# EAGLE design LIC_rack_backplane_Con-00 (EAGLE 7.2.0)
AUTHOR: M. Petrilak; VERSION: 0.1

## Sheet 1 of 2
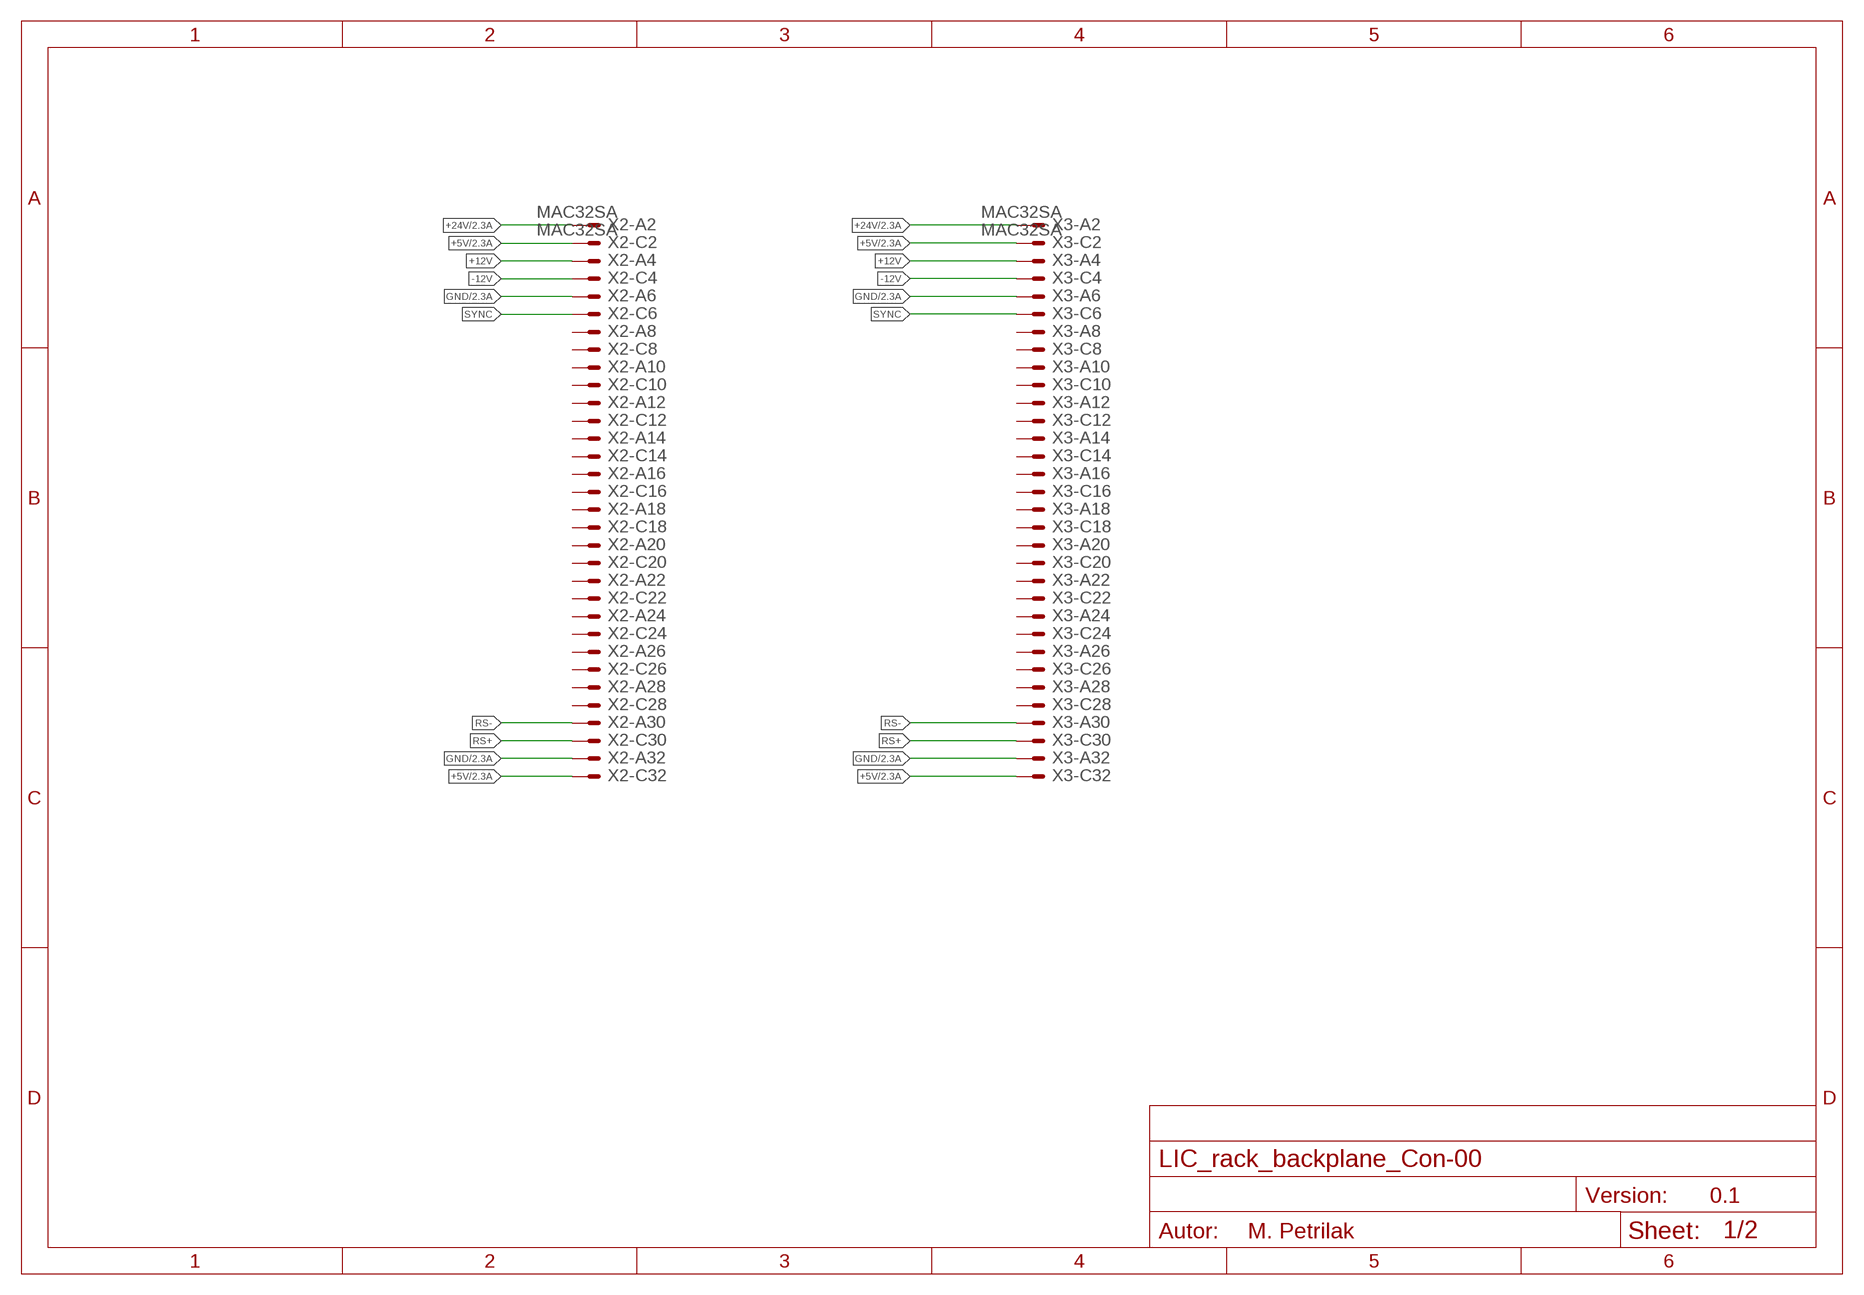
[diagram p0: schematic, sheet 1]

### Parts
X2  MAC32SA  [MAC32SA]
X3  MAC32SA  [MAC32SA]

### Nets
+5V: X2.C2 X2.C32 X3.C2 X3.C32 ; also sheet 2
+12V: X2.A4 X3.A4
+24V: X2.A2 X3.A2 ; also sheet 2
-12V: X2.C4 X3.C4
GND: X2.A6 X2.A32 X3.A6 X3.A32 ; also sheet 2
RS+: X2.C30 X3.C30
RS-: X2.A30 X3.A30
SYNC: X2.C6 X3.C6
Unconnected: X2.A8 X2.A10 X2.A12 X2.A14 X2.A16 X2.A18 X2.A20 X2.A22 X2.A24 X2.A26 X2.A28 X2.C8 X2.C10 X2.C12 X2.C14 X2.C16 X2.C18 X2.C20 X2.C22 X2.C24 X2.C26 X2.C28 X3.A8 X3.A10 X3.A12 X3.A14 X3.A16 X3.A18 X3.A20 X3.A22 X3.A24 X3.A26 X3.A28 X3.C8 X3.C10 X3.C12 X3.C14 X3.C16 X3.C18 X3.C20 X3.C22 X3.C24 X3.C26 X3.C28

## Sheet 2 of 2
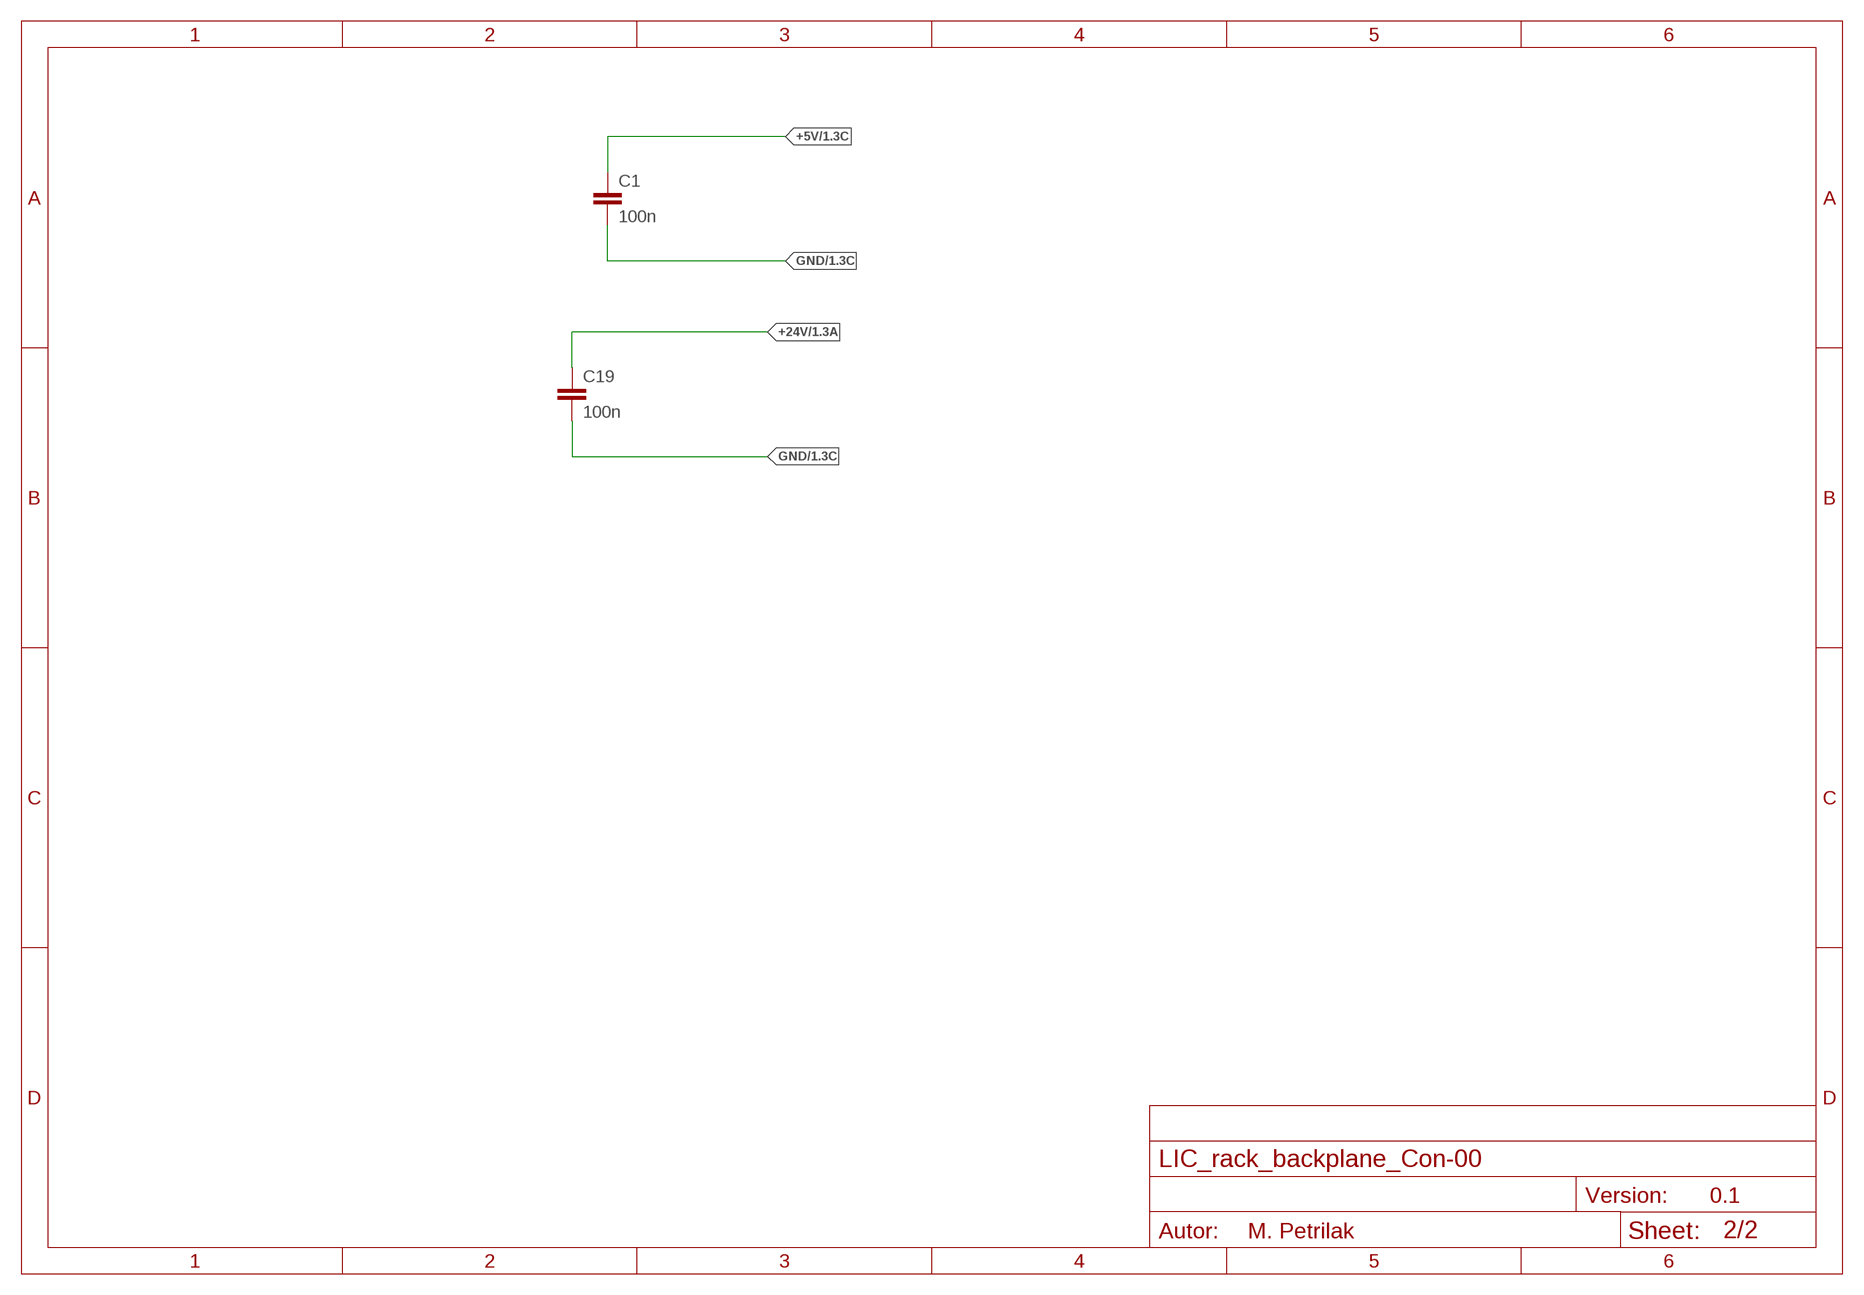
[diagram p1: schematic, sheet 2]

### Parts
C1  100n  C-EUC1206  [C1206]
C19  100n  C-EUC1206  [C1206]

### Nets
+5V: C1.1 ; also sheet 1
+24V: C19.1 ; also sheet 1
GND: C1.2 C19.2 ; also sheet 1

## Library data of the parts
C1 C19 = rcl:C-EU: CAPACITOR, European symbol
X2 X3 = con-vg:MAC32SA: CONNECTOR male, 32 pins, type D, rows AC, grid 5.08 mm

## Net classes
0 default: clearance 0.2 mm
1 LNPE: clearance 2.5 mm to class 0, clearance 1 mm

## Board
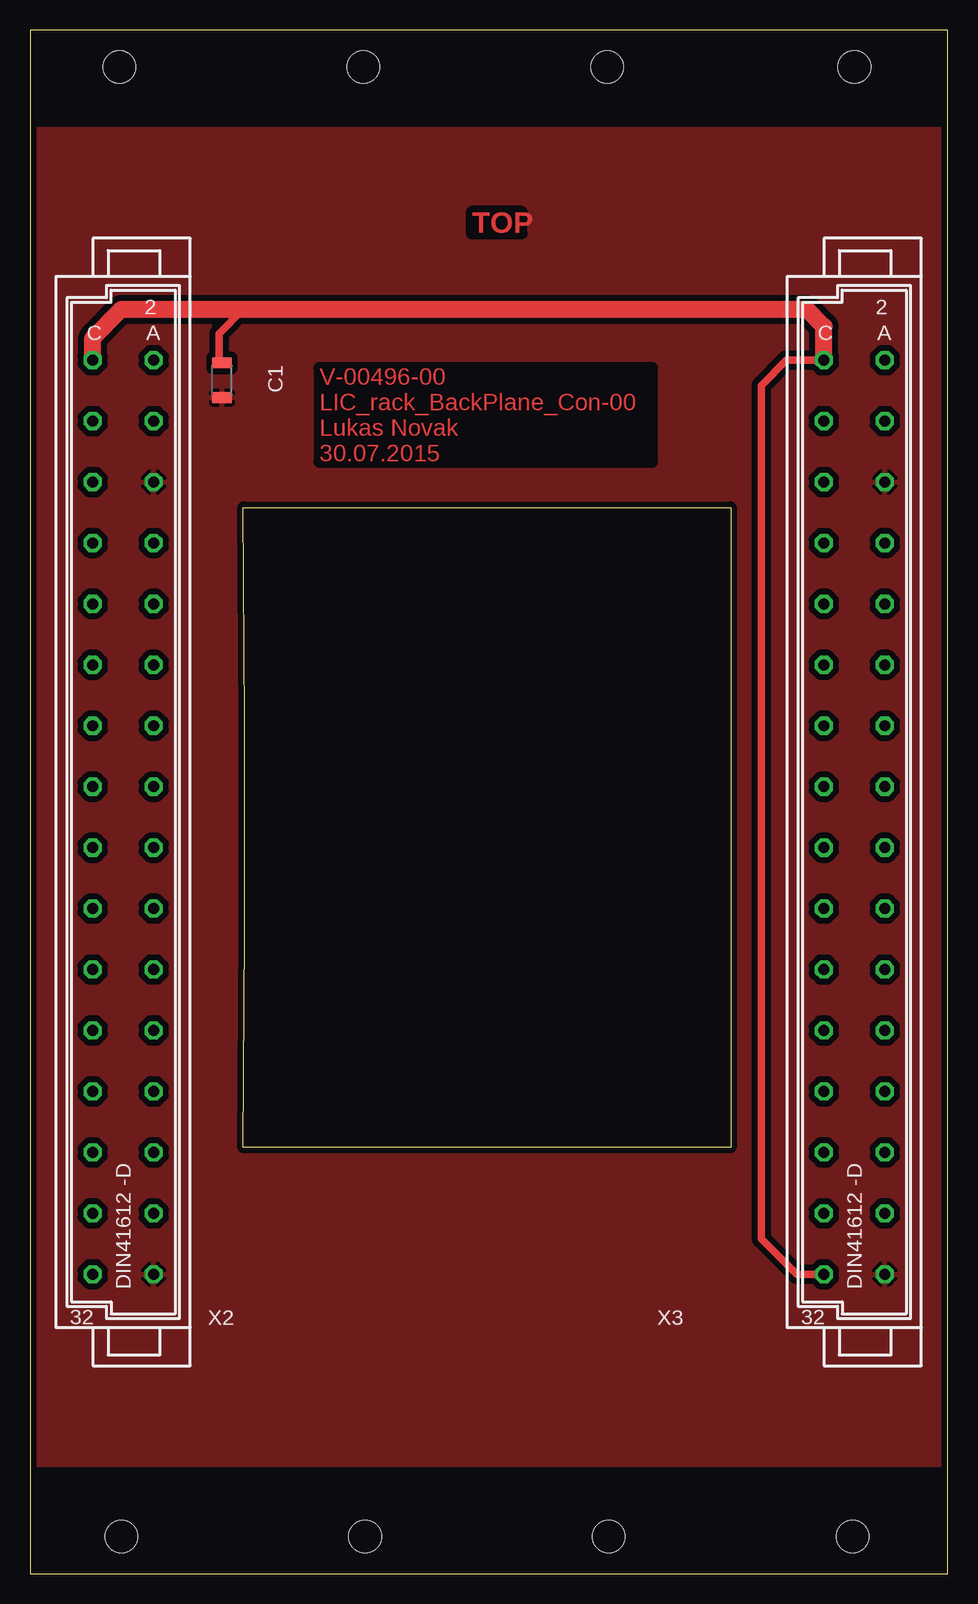
[diagram p2: board, top side]
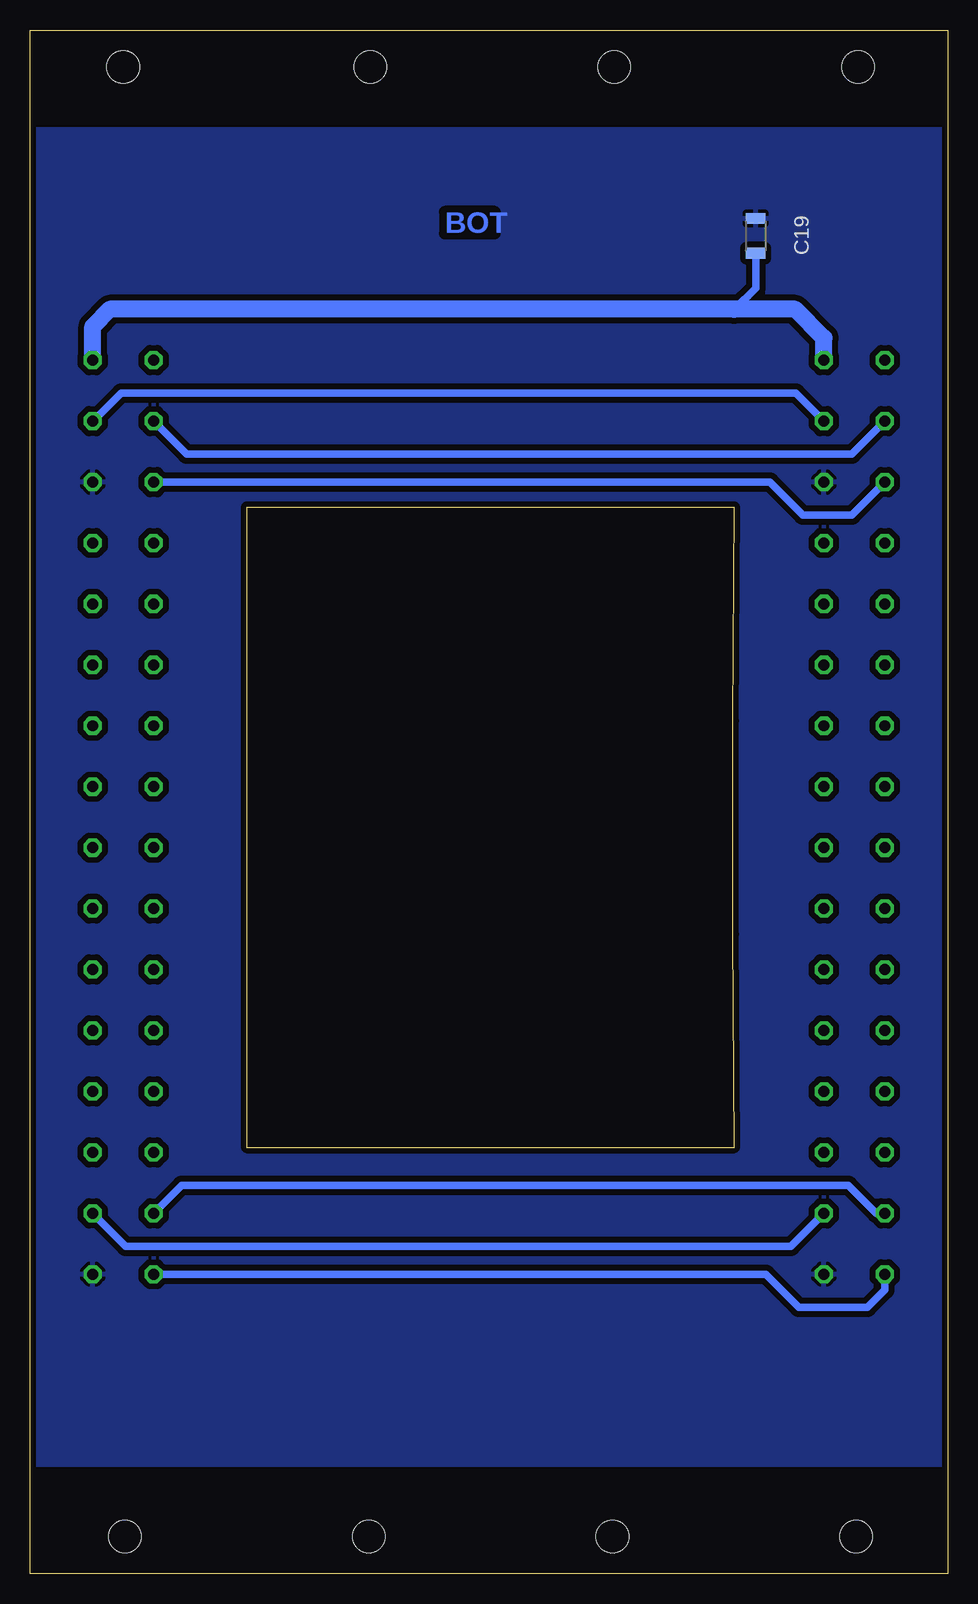
[diagram p3: board, bottom side, seen from below]

Size 76.5 x 128.7 mm. Coordinates in mm from the lower left corner, seen from the top.
Outline: 0,0 76.5,0 76.5,128.7 0,128.7 0,0
Outline: 17.78,88.9 58.42,88.9 58.42,35.56 17.78,35.56 arc1 17.78,88.9
Copper layers (1*16): Top 0.04mm / dielectric 1.5mm / Bottom 0.04mm
Design rules "mucha_navrh *": minimum track width 0.2mm, minimum drill 0.6mm, track to track 0.5mm, track to pad 0.5mm, pad to pad 0.3mm, via to via 0.3mm, smd to smd 0mil, copper to edge 0.5mm, drill to drill 0.5mm, minimum pad ring 0.3mm, minimum via ring 0.3mm, stop-mask expansion 0.1mm, vias tented up to drill 0.8mm, thermal gap 0.3mm
Holes 2.7 mm at 7.47,125.6 27.79,125.6 48.11,125.6 68.73,125.6 7.62,3.1 27.94,3.1 48.26,3.1 68.58,3.1
tRestrict: area 0,120.7 to 76.2,128.3; area 0,0 to 76.2,8.9
bRestrict: area 17.8,35.6 to 58.4,88.9; area 0,0 to 76.2,8.9; area 0,120.7 to 76.2,128.3; 4 lines
vRestrict: area 0,120.7 to 76.2,128.3; area 0,0 to 76.2,8.9

### Footprints (pad centres in the part's own frame; a part is rotated, then mirrored left to right if it is on the bottom)
C1206 = smd 0.9 x 1.6: 1 -1.45,0; 2 1.45,0
MAC32SA = drill 0.914 octagon: A2 2.54,36.83; A4 2.54,31.75; A6 2.54,26.67; A8 2.54,21.59; A10 2.54,16.51; A12 2.54,11.43; A14 2.54,6.35; A16 2.54,1.27; A18 2.54,-3.81; A20 2.54,-8.89; A22 2.54,-13.97; A24 2.54,-19.05; A26 2.54,-24.13; A28 2.54,-29.21; A30 2.54,-34.29; A32 2.54,-39.37; C2 -2.54,36.83; C4 -2.54,31.75; C6 -2.54,26.67; C8 -2.54,21.59; C10 -2.54,16.51; C12 -2.54,11.43; C14 -2.54,6.35; C16 -2.54,1.27; C18 -2.54,-3.81; C20 -2.54,-8.89; C22 -2.54,-13.97; C24 -2.54,-19.05; C26 -2.54,-24.13; C28 -2.54,-29.21; C30 -2.54,-34.29; C32 -2.54,-39.37

### Placement (x,y rotation side)
C1  16,99.5 270 top
C19  16,111.54 90 bottom
X2  7.77,64.35 0 top
X3  68.73,64.35 0 top

### Tracks (layer width: path | path; a pad name or v marks a point on that pad's centre or on a via)
+5V
  Top 0.406: 15.77,101.18 C1.1
  Top 0.61: 15.77,101.18 15.77,103.4 17.78,105.41 | X3.C32 63.92,24.98 60.96,27.94 60.96,99.06 63.08,101.18 X3.C2
  Top 1.422: X2.C2 5.23,103.02 7.62,105.41 17.78,105.41 64.77,105.41 66.19,103.99 X3.C2
  Bottom 0.61: X3.C32 15.14,24.98 12.38,22.23 6.67,22.23 5.23,23.66 X2.C32
+12V
  Bottom 0.61: X3.A4 71.22,96.1 68.9,98.42 12.63,98.42 X2.A4
+24V
  Bottom 0.61: C19.1 16,107.19 17.78,105.41
  Bottom 1.422: X2.A2 10.31,103.02 12.7,105.41 17.78,105.41 69.85,105.41 71.27,103.99 X3.A2
-12V
  Bottom 0.61: X3.C4 63.44,93.34 7.99,93.34 X2.C4
GND
  pour Bottom (rank 2): 0,0 76.5,0 76.5,128.7 0,128.7
  pour Top (rank 2): 0,0 76.5,0 76.5,128.7 0,128.7
RS+
  Bottom 0.61: X2.C30 5.93,30.06 8.26,32.38 63.87,32.38 X3.C30
RS-
  Bottom 0.61: X3.A30 68.52,27.3 13.06,27.3 X2.A30
SYNC
  Bottom 0.61: X2.C6 7.99,88.27 12.06,88.27 14.82,91.02 X3.C6

### Text on the board
Top: TOP | V-00496-00 / LIC_rack_BackPlane_Con-00 / Lukas Novak / 30.07.2015
Bottom: BOT